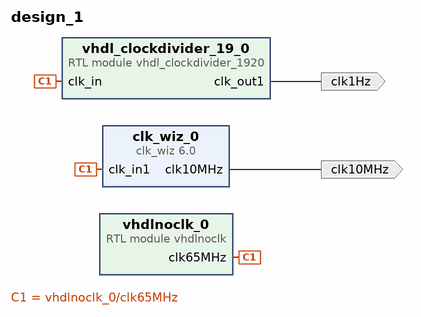
[diagram p0: block diagram of the top level]
# Vivado block design design_1, xc7z007sclg225-1, Vivado 2019.2
create_bd_design design_1

create_bd_port -dir O clk1Hz
create_bd_port -dir O -type clk clk10MHz
set_property -dict {CONFIG.FREQ_HZ 10000000} [get_bd_ports clk10MHz]

create_bd_cell -type module -reference vhdlnoclk vhdlnoclk_0
create_bd_cell -type ip -vlnv xilinx.com:ip:clk_wiz:6.0 clk_wiz_0
set_property -dict [list \
  CONFIG.CLKIN1_JITTER_PS 153.84 \
  CONFIG.CLKOUT1_JITTER 240.438 \
  CONFIG.CLKOUT1_PHASE_ERROR 106.709 \
  CONFIG.CLKOUT1_REQUESTED_OUT_FREQ 10 \
  CONFIG.CLK_OUT1_PORT clk10MHz \
  CONFIG.MMCM_CLKFBOUT_MULT_F 15.500 \
  CONFIG.MMCM_CLKIN1_PERIOD 15.385 \
  CONFIG.MMCM_CLKIN2_PERIOD 10.0 \
  CONFIG.MMCM_CLKOUT0_DIVIDE_F 100.750 \
  CONFIG.PRIM_IN_FREQ 65 \
  CONFIG.USE_LOCKED false \
  CONFIG.USE_RESET false \
] [get_bd_cells clk_wiz_0]
create_bd_cell -type module -reference vhdl_clockdivider_1920 vhdl_clockdivider_19_0

# ---- connections ----

connect_bd_net [get_bd_pins vhdl_clockdivider_19_0/clk_out1] [get_bd_ports clk1Hz]
connect_bd_net [get_bd_pins vhdlnoclk_0/clk65MHz] [get_bd_pins clk_wiz_0/clk_in1] [get_bd_pins vhdl_clockdivider_19_0/clk_in]
connect_bd_net [get_bd_pins clk_wiz_0/clk10MHz] [get_bd_ports clk10MHz]

validate_bd_design
save_bd_design
